# EAGLE design imu_3_xy (EAGLE 6.1)

## Sheet 1 of 2
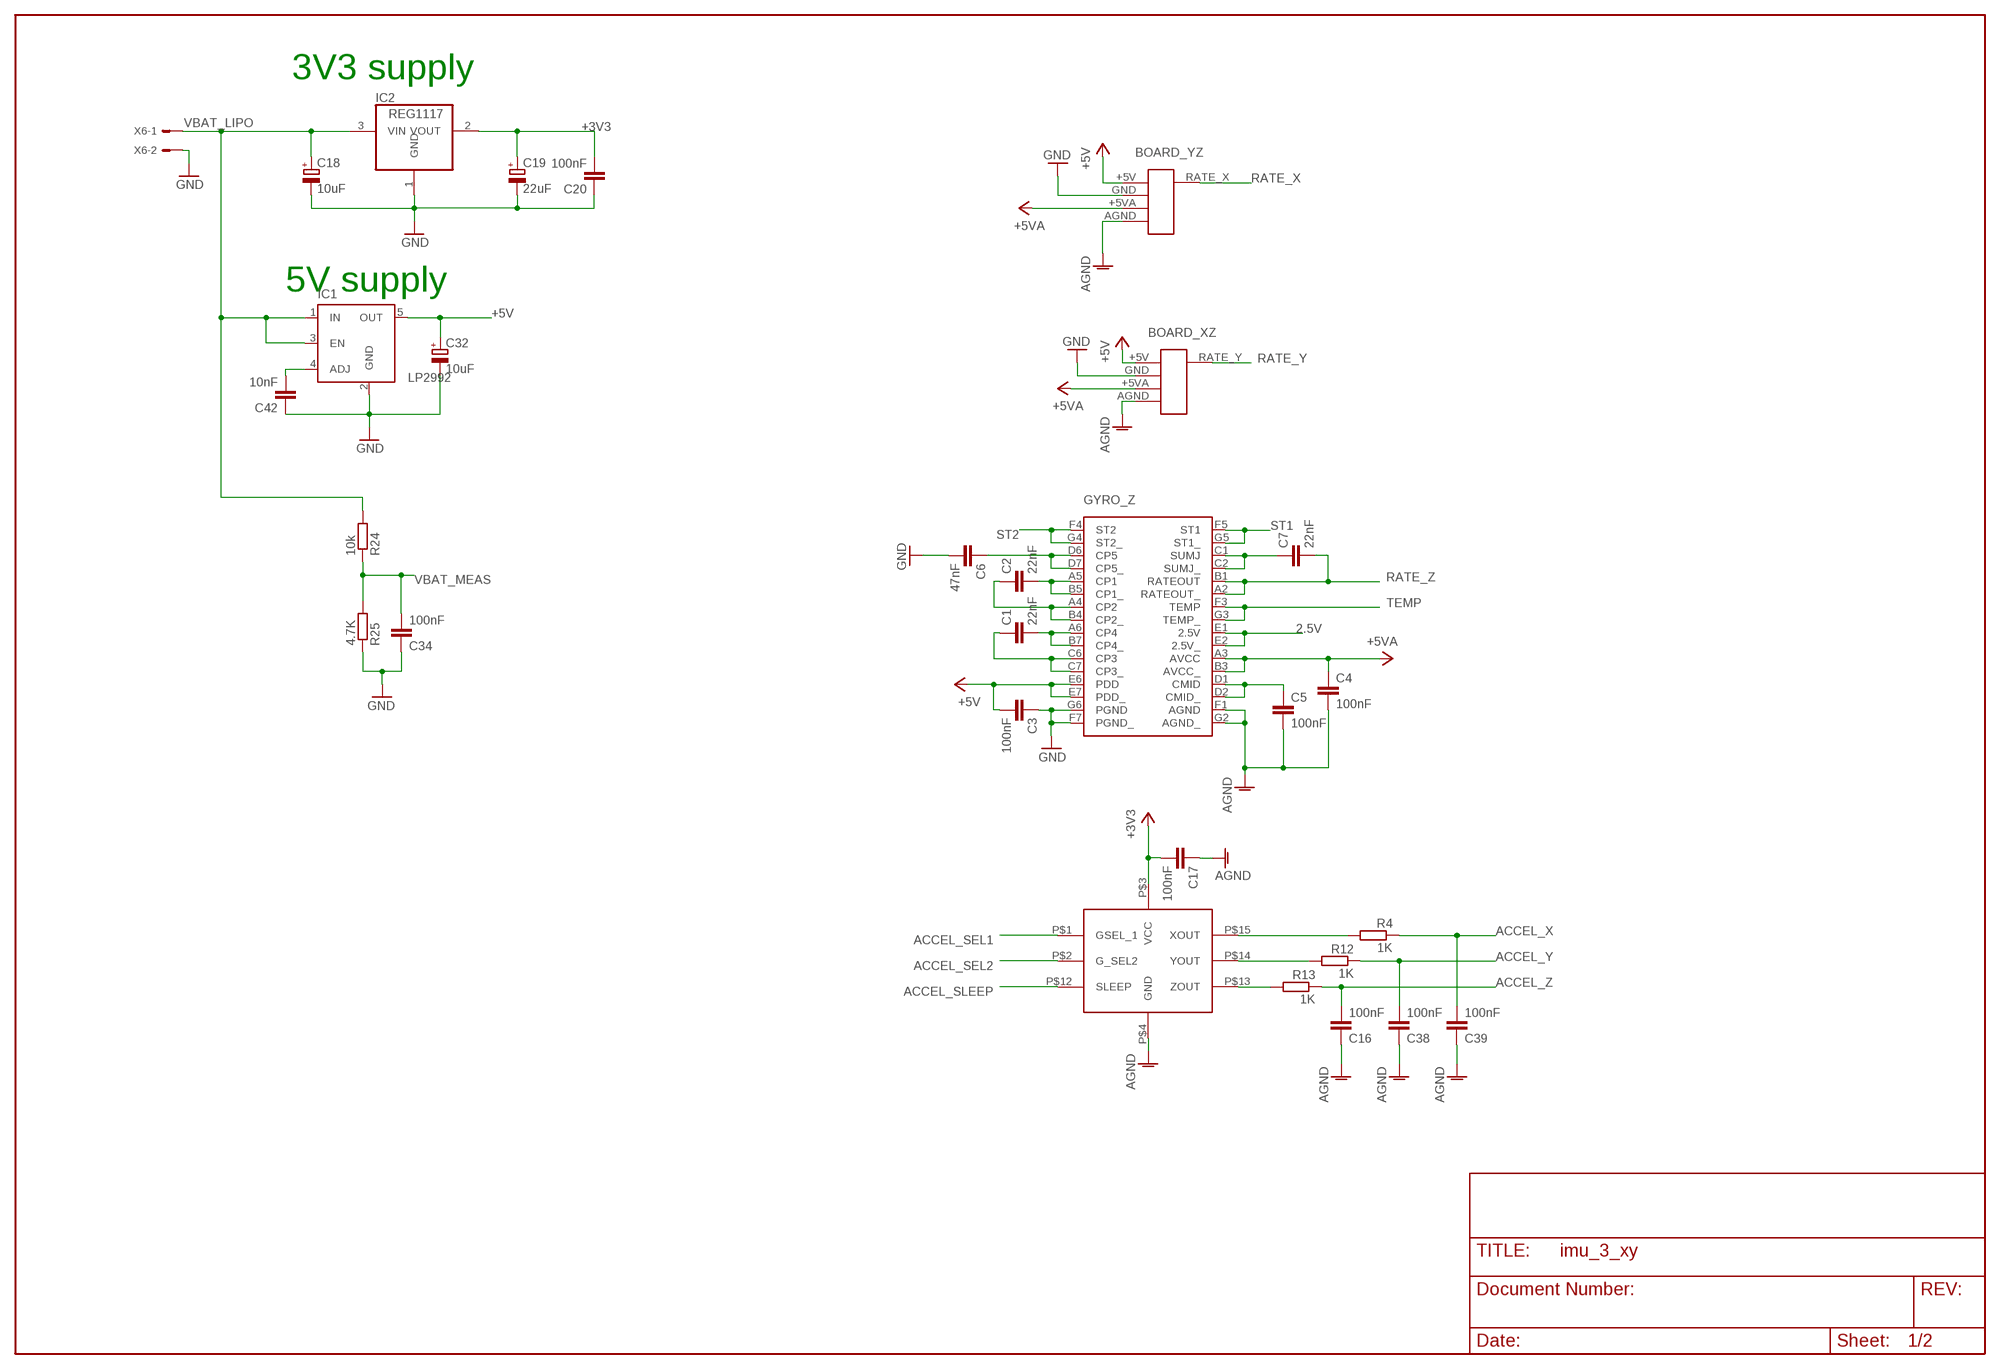
[diagram p0: schematic, sheet 1]

### Parts
BOARD_XZ  IMU_XZ_3  [IMU_XZ_3]
BOARD_YZ  IMU_YZ_3  [IMU_YZ_3]
C1  22nF  C-EUC0402K  [C0402K]
C2  22nF  C-EUC0402K  [C0402K]
C3  100nF  C-EUC0402K  [C0402K]
C4  100nF  C-EUC0402K  [C0402K]
C5  100nF  C-EUC0402K  [C0402K]
C6  47nF  C-EUC0402K  [C0402K]
C7  22nF  C-EUC0402K  [C0402K]
C16  100nF  C-EUC0402K  [C0402K]
C17  100nF  C-EUC0402K  [C0402K]
C18  10uF  CPOL-EUA/3216-18R  [A/3216-18R]
C19  22uF  CPOL-EUB/3528-21R  [B/3528-21R]
C20  100nF  C-EUC0603K  [C0603K]
C32  10uF  CPOL-EUA/3216-18R  [A/3216-18R]
C34  100nF  C-EUC0402K  [C0402K]
C38  100nF  C-EUC0402K  [C0402K]
C39  100nF  C-EUC0402K  [C0402K]
C42  10nF  C-EUC0402K  [C0402K]
GYRO_Z  ADXR  [BC-32]
IC1  LP2992  MIC5219BM5  [SOT23-5]
IC2  REG1117  [SOT223]
R4  1K  R-EU_R0402  [R0402]
R12  1K  R-EU_R0402  [R0402]
R13  1K  R-EU_R0402  [R0402]
R24  10k  R-EU_R0402  [R0402]
R25  4.7K  R-EU_R0402  [R0402]
U$5  MMA7260  [CASE162201]
X6  53048-02  [53048-02]

### Nets
2.5V: GYRO_Z.E1(2.5V) GYRO_Z.E2(2.5V_)
+3V3: C17.2 C19.+ C20.2 IC2.2(VOUT) U$5.P$3(VCC) ; also sheet 2
+5V: BOARD_XZ.+5V BOARD_YZ.+5V C3.2 C32.+ GYRO_Z.E6(PDD) GYRO_Z.E7(PDD_) IC1.5(OUT) ; also sheet 2
+5VA: BOARD_XZ.+5VA BOARD_YZ.+5VA C4.1 GYRO_Z.A3(AVCC) GYRO_Z.B3(AVCC_) ; also sheet 2
ACCEL_SEL1: U$5.P$1(GSEL_1) ; also sheet 2
ACCEL_SEL2: U$5.P$2(G_SEL2) ; also sheet 2
ACCEL_SLEEP: U$5.P$12(SLEEP) ; also sheet 2
ACCEL_X: C39.2 R4.1 ; also sheet 2
ACCEL_Y: C38.2 R12.1 ; also sheet 2
ACCEL_Z: C16.2 R13.1 ; also sheet 2
AGND: BOARD_XZ.AGND BOARD_YZ.AGND C4.2 C5.2 C16.1 C17.1 C38.1 C39.1 GYRO_Z.F1(AGND) GYRO_Z.G2(AGND_) U$5.P$4(GND) ; also sheet 2
GND: BOARD_XZ.GND BOARD_YZ.GND C3.1 C6.2 C18.- C19.- C20.1 C32.- C34.1 C42.1 GYRO_Z.F7(PGND_) GYRO_Z.G6(PGND) IC1.2(GND) IC2.1(GND) R25.1 X6.2 ; also sheet 2
N$1: C1.2 GYRO_Z.A6(CP4) GYRO_Z.B7(CP4_)
N$2: C1.1 GYRO_Z.C6(CP3) GYRO_Z.C7(CP3_)
N$3: C2.2 GYRO_Z.A5(CP1) GYRO_Z.B5(CP1_)
N$4: C2.1 GYRO_Z.A4(CP2) GYRO_Z.B4(CP2_)
N$6: R4.2 U$5.P$15(XOUT)
N$8: C7.1 GYRO_Z.C1(SUMJ) GYRO_Z.C2(SUMJ_)
N$9: C6.1 GYRO_Z.D6(CP5) GYRO_Z.D7(CP5_)
N$10: C5.1 GYRO_Z.D1(CMID) GYRO_Z.D2(CMID_)
N$11: R12.2 U$5.P$14(YOUT)
N$12: R13.2 U$5.P$13(ZOUT)
N$23: C42.2 IC1.4(ADJ)
RATE_X: BOARD_YZ.RATE_X(RATE) ; also sheet 2
RATE_Y: BOARD_XZ.RATE_Y(RATE) ; also sheet 2
RATE_Z: C7.2 GYRO_Z.A2(RATEOUT_) GYRO_Z.B1(RATEOUT) ; also sheet 2
ST1: GYRO_Z.F5(ST1) GYRO_Z.G5(ST1_)
ST2: GYRO_Z.F4(ST2) GYRO_Z.G4(ST2_)
TEMP: GYRO_Z.F3(TEMP) GYRO_Z.G3(TEMP_) ; also sheet 2
VBAT_LIPO: C18.+ IC1.1(IN) IC1.3(EN) IC2.3(VIN) R24.2 X6.1
VBAT_MEAS: C34.2 R24.1 R25.2 ; also sheet 2

### Notes on the sheet
- 3V3 supply
- 5V supply

## Sheet 2 of 2
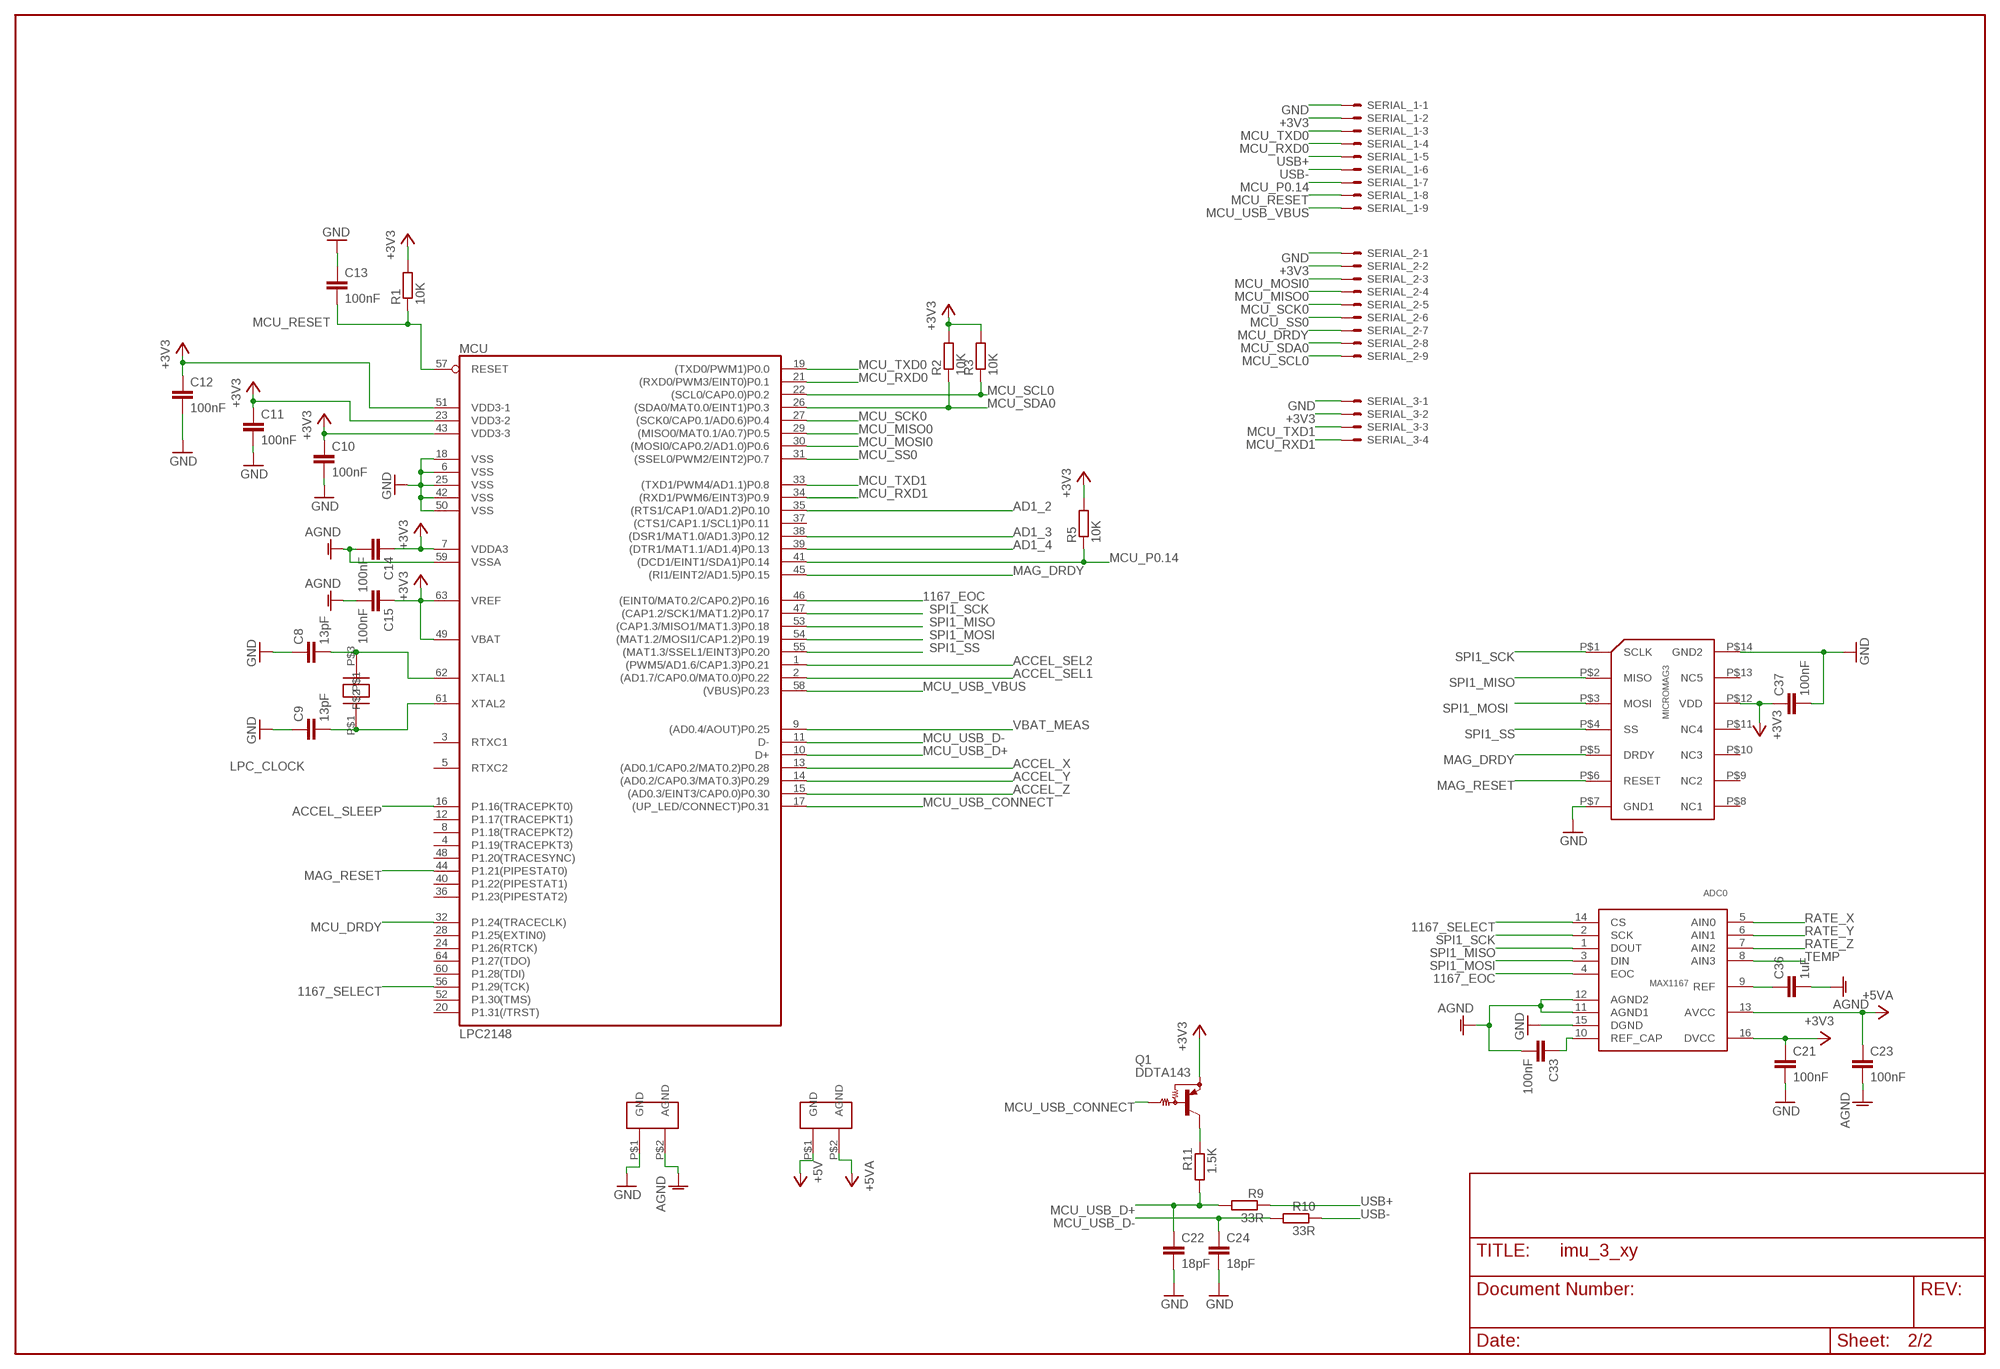
[diagram p1: schematic, sheet 2]

### Parts
ADC0  MAX1167  [QSOP16]
C8  13pF  C-EUC0402K  [C0402K]
C9  13pF  C-EUC0402K  [C0402K]
C10  100nF  C-EUC0402K  [C0402K]
C11  100nF  C-EUC0402K  [C0402K]
C12  100nF  C-EUC0402K  [C0402K]
C13  100nF  C-EUC0402K  [C0402K]
C14  100nF  C-EUC0402K  [C0402K]
C15  100nF  C-EUC0402K  [C0402K]
C21  100nF  C-EUC0402K  [C0402K]
C22  18pF  C-EUC0402K  [C0402K]
C23  100nF  C-EUC0402K  [C0402K]
C24  18pF  C-EUC0402K  [C0402K]
C33  100nF  C-EUC0402K  [C0402K]
C36  1uF  C-EUC0805  [C0805]
C37  100nF  C-EUC0402K  [C0402K]
CRYSTAL1  14.764Mhz  CRYSTAL_CTS  [CTS_CRYSTAL]
MCU  LPC2148  [SQFP-S-10X10-64]
Q1  DDTA143  MUN2111T1  [SC59-BEC]
R1  10K  R-EU_R0402  [R0402]
R2  10K  R-EU_R0402  [R0402]
R3  10K  R-EU_R0402  [R0402]
R5  10K  R-EU_R0402  [R0402]
R9  33R  R-EU_R1005  [R1005]
R10  33R  R-EU_R1005  [R1005]
R11  1.5K  R-EU_R1005  [R1005]
SERIAL_1  53048-09  [53048-09]
SERIAL_2  53048-09  [53048-09]
SERIAL_3  53048-04  [53048-04]
U$9  MICROMAG3  [MICROMAG3]
U$11  TEST_CON_GP  [TEST_CON_GP]
U$21  TEST_CON_GP  [TEST_CON_GP]

### Nets
1167_EOC: ADC0.4(EOC) MCU.46((EINT0/MAT0.2/CAP0.2)P0.16)
1167_SELECT: ADC0.14(CS) MCU.56(P1.29(TCK))
+3V3: ADC0.16(DVCC) C10.1 C11.1 C12.1 C14.1 C15.1 C21.1 C37.1 MCU.7(VDDA3) MCU.23(VDD3-2) MCU.43(VDD3-3) MCU.49(VBAT) MCU.51(VDD3-1) MCU.63(VREF) Q1.E R1.2 R2.2 R3.2 R5.2 SERIAL_1.2 SERIAL_2.2 SERIAL_3.2 U$9.P$12(VDD) ; also sheet 1
+5V: U$21.P$1(GND) ; also sheet 1
+5VA: ADC0.13(AVCC) C23.1 U$21.P$2(AGND) ; also sheet 1
ACCEL_SEL1: MCU.2((AD1.7/CAP0.0/MAT0.0)P0.22) ; also sheet 1
ACCEL_SEL2: MCU.1((PWM5/AD1.6/CAP1.3)P0.21) ; also sheet 1
ACCEL_SLEEP: MCU.16(P1.16(TRACEPKT0)) ; also sheet 1
ACCEL_X: MCU.13((AD0.1/CAP0.2/MAT0.2)P0.28) ; also sheet 1
ACCEL_Y: MCU.14((AD0.2/CAP0.3/MAT0.3)P0.29) ; also sheet 1
ACCEL_Z: MCU.15((AD0.3/EINT3/CAP0.0)P0.30) ; also sheet 1
AD1_2: MCU.35((RTS1/CAP1.0/AD1.2)P0.10)
AD1_3: MCU.38((DSR1/MAT1.0/AD1.3)P0.12)
AD1_4: MCU.39((DTR1/MAT1.1/AD1.4)P0.13)
AGND: ADC0.11(AGND1) ADC0.12(AGND2) C14.2 C15.2 C23.2 C33.2 C36.2 MCU.59(VSSA) U$11.P$2(AGND) ; also sheet 1
GND: ADC0.15(DGND) C8.1 C9.1 C10.2 C11.2 C12.2 C13.1 C21.2 C22.2 C24.2 C37.2 MCU.6(VSS) MCU.18(VSS) MCU.25(VSS) MCU.42(VSS) MCU.50(VSS) SERIAL_1.1 SERIAL_2.1 SERIAL_3.1 U$9.P$7(GND1) U$9.P$14(GND2) U$11.P$1(GND) ; also sheet 1
LPC_CLOCK: C9.2 CRYSTAL1.P$1 MCU.61(XTAL2)
MAG_DRDY: MCU.45((RI1/EINT2/AD1.5)P0.15) U$9.P$5(DRDY)
MAG_RESET: MCU.44(P1.21(PIPESTAT0)) U$9.P$6(RESET)
MCU_DRDY: MCU.32(P1.24(TRACECLK)) SERIAL_2.7
MCU_MISO0: MCU.29((MISO0/MAT0.1/A0.7)P0.5) SERIAL_2.4
MCU_MOSI0: MCU.30((MOSI0/CAP0.2/AD1.0)P0.6) SERIAL_2.3
MCU_P0.14: MCU.41((DCD1/EINT1/SDA1)P0.14) R5.1 SERIAL_1.7
MCU_RESET: C13.2 MCU.57(RESET) R1.1 SERIAL_1.8
MCU_RXD0: MCU.21((RXD0/PWM3/EINT0)P0.1) SERIAL_1.4
MCU_RXD1: MCU.34((RXD1/PWM6/EINT3)P0.9) SERIAL_3.4
MCU_SCK0: MCU.27((SCK0/CAP0.1/AD0.6)P0.4) SERIAL_2.5
MCU_SCL0: MCU.22((SCL0/CAP0.0)P0.2) R3.1 SERIAL_2.9
MCU_SDA0: MCU.26((SDA0/MAT0.0/EINT1)P0.3) R2.1 SERIAL_2.8
MCU_SS0: MCU.31((SSEL0/PWM2/EINT2)P0.7) SERIAL_2.6
MCU_TXD0: MCU.19((TXD0/PWM1)P0.0) SERIAL_1.3
MCU_TXD1: MCU.33((TXD1/PWM4/AD1.1)P0.8) SERIAL_3.3
MCU_USB_CONNECT: MCU.17((UP_LED/CONNECT)P0.31) Q1.B
MCU_USB_D+: C22.1 MCU.10(D+) R9.2 R11.2
MCU_USB_D-: C24.1 MCU.11(D-) R10.2
MCU_USB_VBUS: MCU.58((VBUS)P0.23) SERIAL_1.9
N$7: C8.2 CRYSTAL1.P$3 MCU.62(XTAL1)
N$14: Q1.C R11.1
N$20: ADC0.10(REF_CAP) C33.1
N$21: ADC0.9(REF) C36.1
RATE_X: ADC0.5(AIN0) ; also sheet 1
RATE_Y: ADC0.6(AIN1) ; also sheet 1
RATE_Z: ADC0.7(AIN2) ; also sheet 1
SPI1_MISO: ADC0.1(DOUT) MCU.53((CAP1.3/MISO1/MAT1.3)P0.18) U$9.P$2(MISO)
SPI1_MOSI: ADC0.3(DIN) MCU.54((MAT1.2/MOSI1/CAP1.2)P0.19) U$9.P$3(MOSI)
SPI1_SCK: ADC0.2(SCK) MCU.47((CAP1.2/SCK1/MAT1.2)P0.17) U$9.P$1(SCLK)
SPI1_SS: MCU.55((MAT1.3/SSEL1/EINT3)P0.20) U$9.P$4(SS)
TEMP: ADC0.8(AIN3) ; also sheet 1
USB+: R9.1 SERIAL_1.5
USB-: R10.1 SERIAL_1.6
VBAT_MEAS: MCU.9((AD0.4/AOUT)P0.25) ; also sheet 1
Unconnected: MCU.3(RTXC1) MCU.4(P1.19(TRACEPKT3)) MCU.5(RTXC2) MCU.8(P1.18(TRACEPKT2)) MCU.12(P1.17(TRACEPKT1)) MCU.20(P1.31(/TRST)) MCU.24(P1.26(RTCK)) MCU.28(P1.25(EXTIN0)) MCU.36(P1.23(PIPESTAT2)) MCU.37((CTS1/CAP1.1/SCL1)P0.11) MCU.40(P1.22(PIPESTAT1)) MCU.48(P1.20(TRACESYNC)) MCU.52(P1.30(TMS)) MCU.60(P1.28(TDI)) MCU.64(P1.27(TDO)) U$9.P$8(NC1) U$9.P$9(NC2) U$9.P$10(NC3) U$9.P$11(NC4) U$9.P$13(NC5)

## Library data of the parts
ADC0 = paparazzi:MAX1167: 16 bits 4 channel ADC
BOARD_XZ = paparazzi:IMU_XZ_3
BOARD_YZ = paparazzi:IMU_YZ_3
C1-C17 C20-C24 C33 C34 C36-C39 C42 = rcl:C-EU: CAPACITOR, European symbol
C18 C19 C32 = rcl:CPOL-EU: POLARIZED CAPACITOR, European symbol
CRYSTAL1 = paparazzi:CRYSTAL_CTS
GYRO_Z = paparazzi:ADXR
IC1 = v-reg-micrel:MIC5219BM5: VOLTAGE REGULATOR
IC2 = burr-brown:REG1117: 800mA and 1A Low Dropout (LDO) Positive Regulator 1.8V, 2.5V, 2.85V, 3.3V, 5V, and Adj
MCU = paparazzi:LPC2148
Q1 = transistor-pnp:MUN2111*: PNP Bias Resistor Transistor
R1-R5 R9-R13 R24 R25 = rcl:R-EU_: RESISTOR, European symbol
SERIAL_1 SERIAL_2 = con-molex:53?-09: CONNECTOR wire to board 1.25 mm (.049 inch) pitch header
SERIAL_3 = con-molex:53?-04: CONNECTOR wire to board 1.25 mm (.049 inch) pitch header
U$5 = paparazzi:MMA7260: 3 axis accelerometer
U$9 = paparazzi:MICROMAG3
U$11 U$21 = paparazzi:TEST_CON_GP
X6 = con-molex:53?-02: CONNECTOR wire to board 1.25 mm (.049 inch) pitch header

## Board
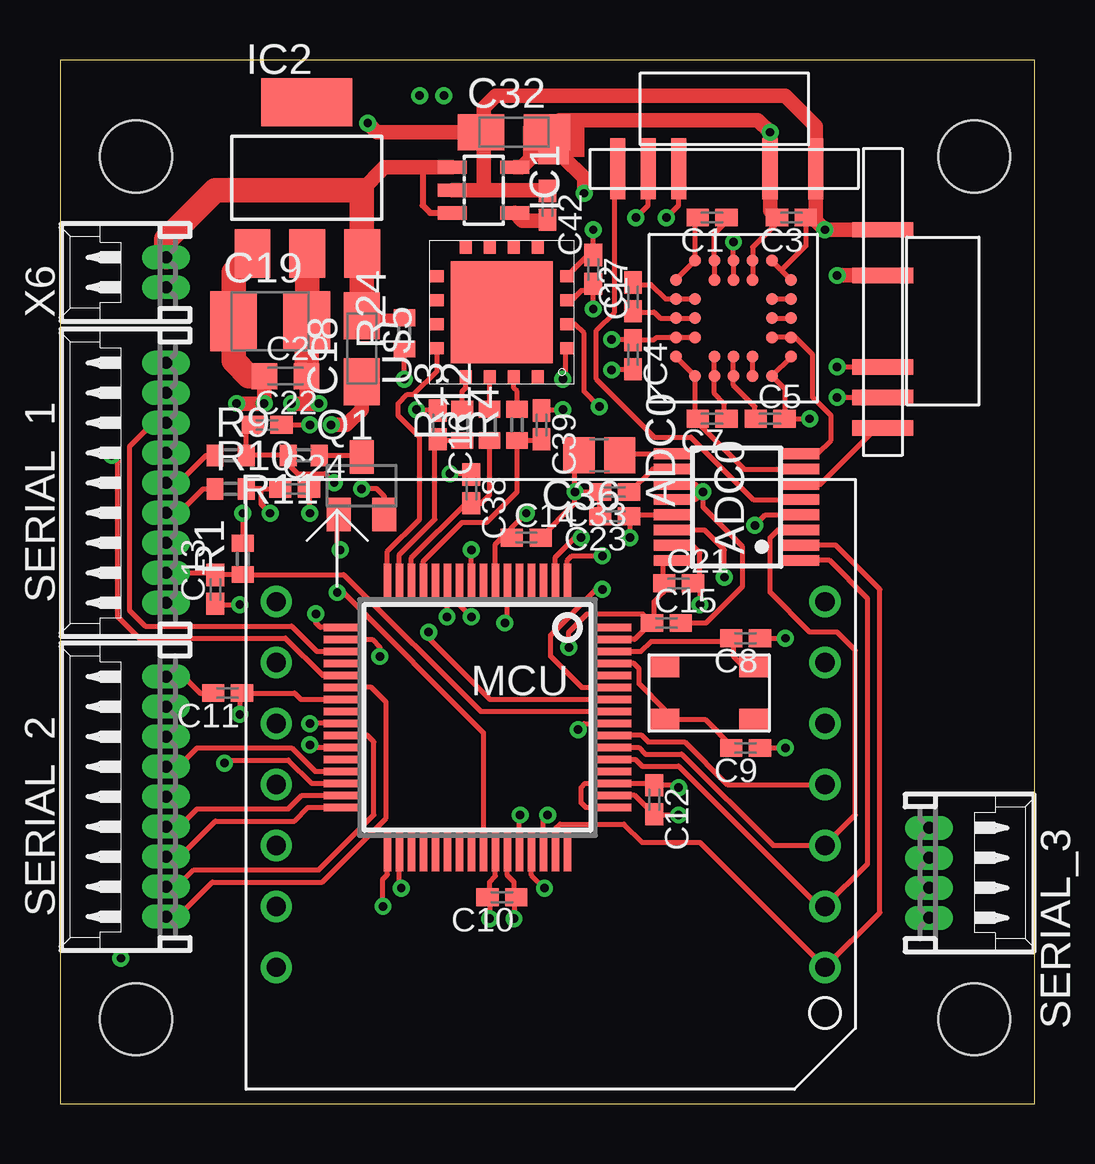
[diagram p2: board, top side]
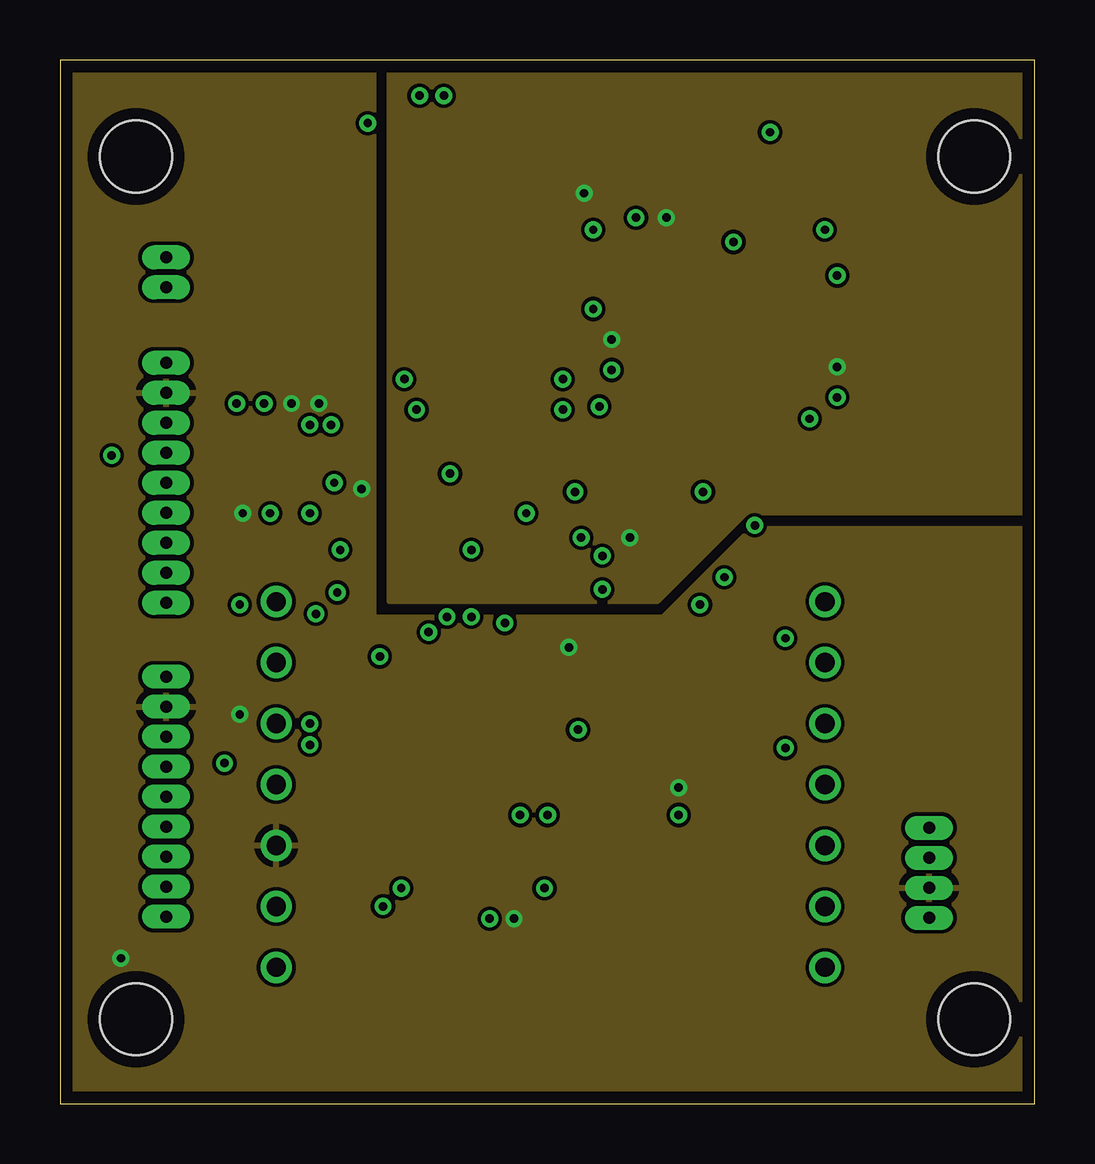
[diagram p3: board, inner layer Route2]
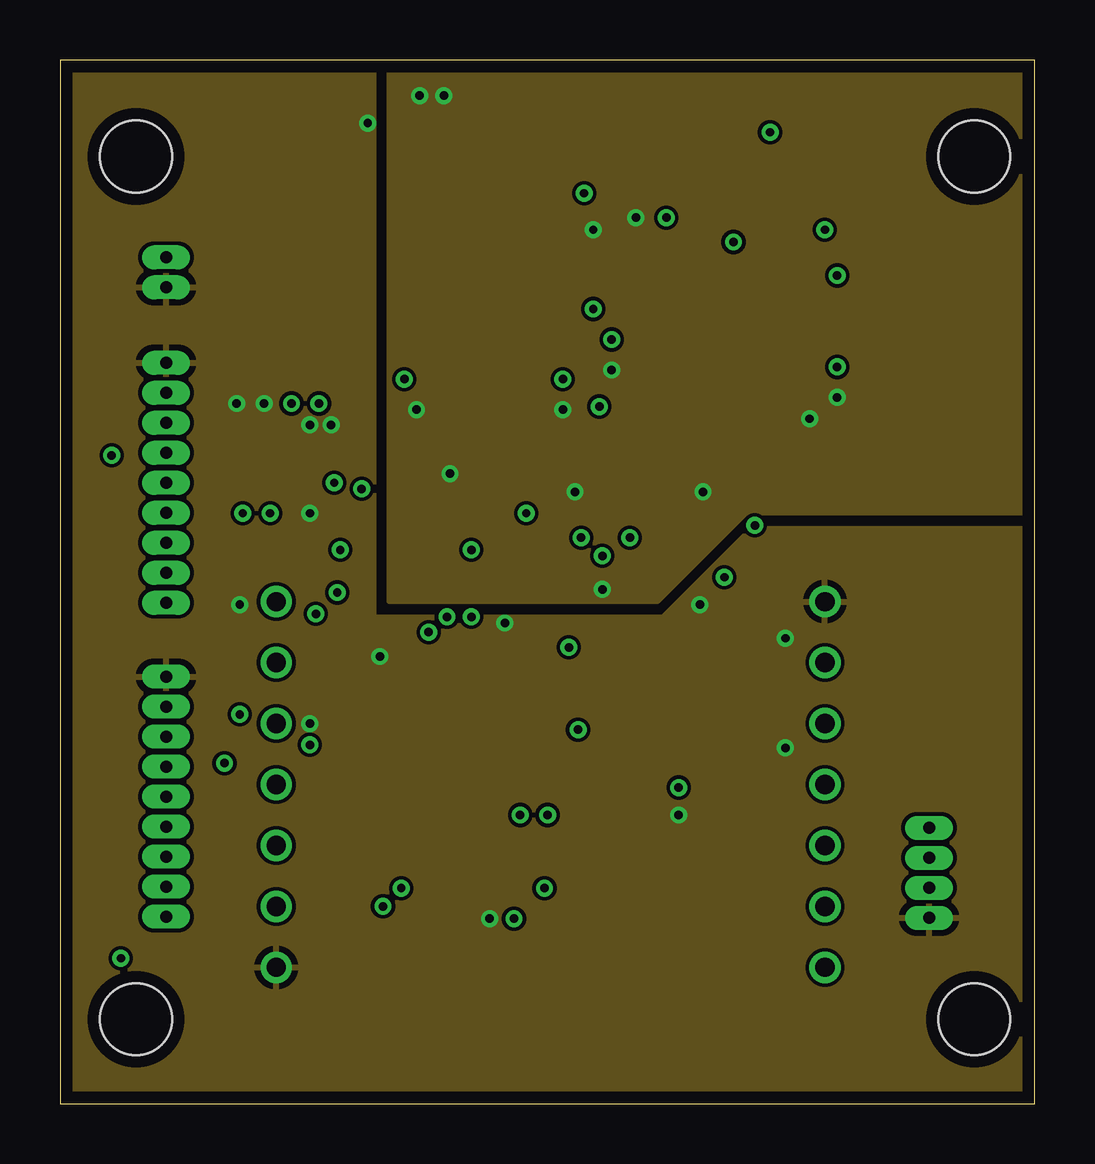
[diagram p4: board, inner layer Route15]
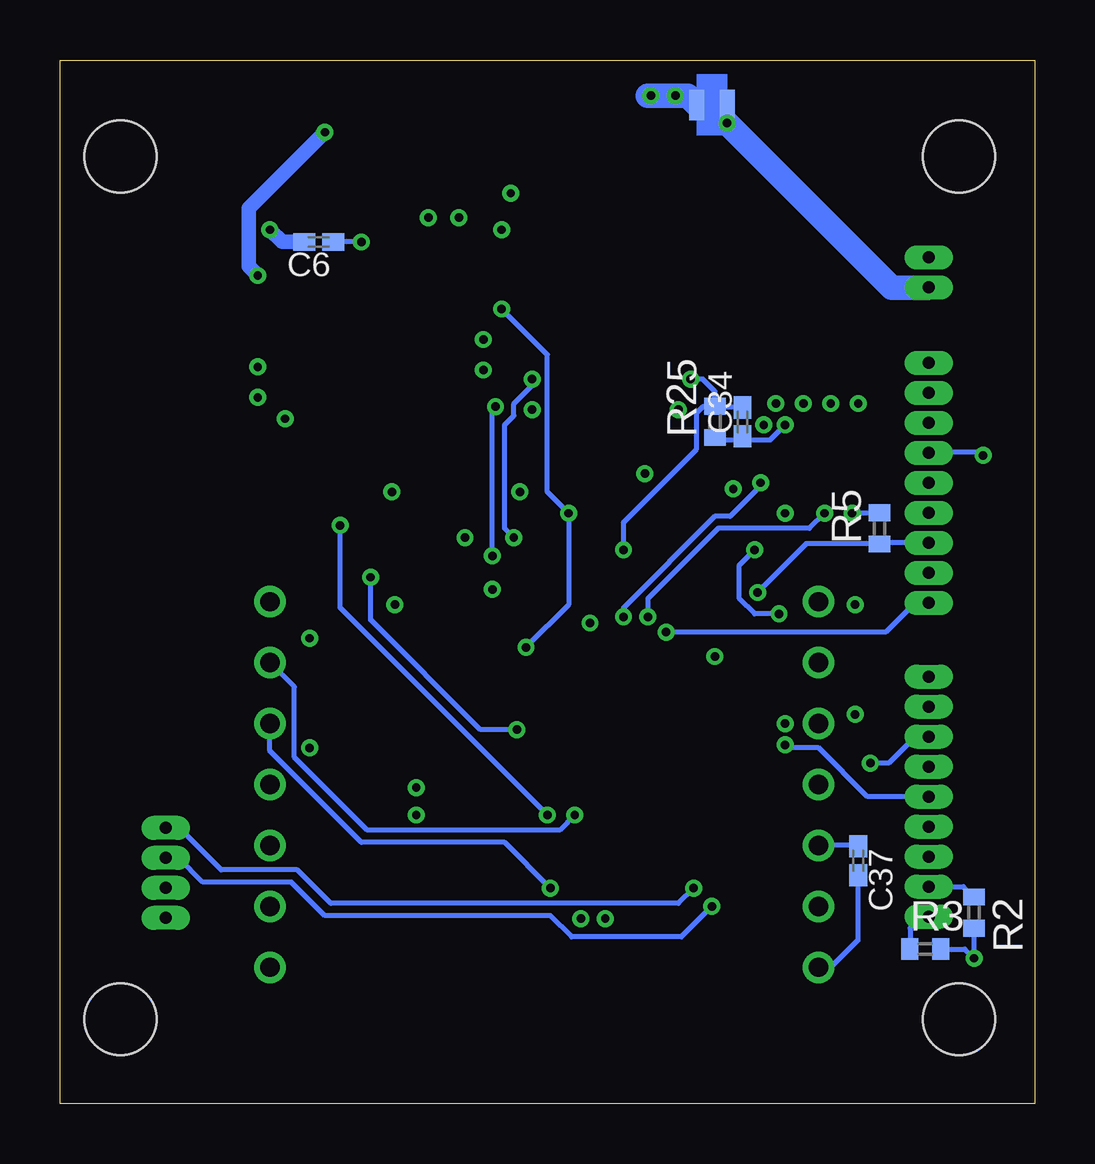
[diagram p5: board, bottom side, seen from below]

Size 40.62 x 43.48 mm. Coordinates in mm from the lower left corner, seen from the top.
Outline: 0,0 40.62,0 40.62,43.48 0,43.48 0,0
Copper layers (1*2+15*16): Top 0.035mm / dielectric 0.2mm / Route2 0.035mm / dielectric 1.5mm / Route15 0.035mm / dielectric 0.2mm / Bottom 0.035mm
Design rules: minimum track width 0.15mm, minimum drill 0.35mm, track to track 0.15mm, track to pad 0.15mm, pad to pad 0.15mm, via to via 0.15mm, smd to smd 0.15mm, copper to edge 20mil, drill to drill 8mil, minimum pad ring 10mil, minimum via ring 7mil, stop-mask expansion 4mil, vias tented up to drill 0mil, thermal gap 10mil
Holes 3 mm at 38.09,39.46 3.17,39.46 3.17,3.52 38.09,3.52

### Footprints (pad centres in the part's own frame; a part is rotated, then mirrored left to right if it is on the bottom)
QSOP16 = smd 0.45 x 1.5: 1 -2.223,-2.69; 2 -1.587,-2.69; 3 -0.953,-2.69; 4 -0.318,-2.69; 5 0.318,-2.69; 6 0.953,-2.69; 7 1.587,-2.69; 8 2.223,-2.69; 9 2.223,2.69; 10 1.587,2.69; 11 0.953,2.69; 12 0.318,2.69; 13 -0.318,2.69; 14 -0.953,2.69; 15 -1.587,2.69; 16 -2.223,2.69
IMU_XZ_3 = smd 0.635 x 2.54: +5V -1.905,0; +5VA 1.905,0; AGND 3.175,0; GND -3.81,0; RATE_Y 4.445,0
IMU_YZ_3 = smd 0.635 x 2.54: +5V 1.905,0; +5VA -1.905,0; AGND -3.175,0; GND 3.81,0; RATE_X -4.445,0
C0402K = smd 0.925 x 0.74: 1 -0.6,0; 2 0.6,0
A/3216-18R = smd 1.95 x 1.5: + 1.375,0; - -1.375,0
B/3528-21R = smd 1.95 x 2.5: + 1.525,0; - -1.525,0
C0603K = smd 1.05 x 1.08: 1 -0.875,0; 2 0.875,0
C0805 = smd 1.3 x 1.5: 1 -0.85,0; 2 0.85,0
CTS_CRYSTAL = smd 1.2 x 0.9: P$1 -1.85,-1.1; P$2 1.85,-1.1; P$3 1.85,1.1; P$4 -1.85,1.1
BC-32 = smd 0.5 x 0.5: A2 -1.6,2.4; A3 -0.8,2.4; A4 0,2.4; A5 0.8,2.4; A6 1.6,2.4; B1 -2.4,1.6; B3 -0.8,1.6; B4 0,1.6; B5 0.8,1.6; B7 2.4,1.6; C1 -2.4,0.8; C2 -1.6,0.8; C6 1.6,0.8; C7 2.4,0.8; D1 -2.4,0; D2 -1.6,0; D6 1.6,0; D7 2.4,0; E1 -2.4,-0.8; E2 -1.6,-0.8; E6 1.6,-0.8; E7 2.4,-0.8; F1 -2.4,-1.6; F3 -0.8,-1.6; F4 0,-1.6; F5 0.8,-1.6; F7 2.4,-1.6; G2 -1.6,-2.4; G3 -0.8,-2.4; G4 0,-2.4; G5 0.8,-2.4; G6 1.6,-2.4
SOT23-5 = smd 0.55 x 1.2: 1 -0.95,-1.3; 2 0,-1.3; 3 0.95,-1.3; 4 0.95,1.3; 5 -0.95,1.3
SOT223 = smd 1.499 x 2.007: 1 -2.261,-3.15; 2 0.025,-3.15; 3 2.311,-3.15 | smd 3.81 x 2.007: 4 0,3.15
SQFP-S-10X10-64 = smd 0.3 x 1.6: 1 -3.75,-5.6; 2 -3.25,-5.6; 3 -2.75,-5.6; 4 -2.25,-5.6; 5 -1.75,-5.6; 6 -1.25,-5.6; 7 -0.75,-5.6; 8 -0.25,-5.6; 9 0.25,-5.6; 10 0.75,-5.6; 11 1.25,-5.6; 12 1.75,-5.6; 13 2.25,-5.6; 14 2.75,-5.6; 15 3.25,-5.6; 16 3.75,-5.6; 33 3.75,5.6; 34 3.25,5.6; 35 2.75,5.6; 36 2.25,5.6; 37 1.75,5.6; 38 1.25,5.6; 39 0.75,5.6; 40 0.25,5.6; 41 -0.25,5.6; 42 -0.75,5.6; 43 -1.25,5.6; 44 -1.75,5.6; 45 -2.25,5.6; 46 -2.75,5.6; 47 -3.25,5.6; 48 -3.75,5.6 | smd 1.6 x 0.3: 17 5.6,-3.75; 18 5.6,-3.25; 19 5.6,-2.75; 20 5.6,-2.25; 21 5.6,-1.75; 22 5.6,-1.25; 23 5.6,-0.75; 24 5.6,-0.25; 25 5.6,0.25; 26 5.6,0.75; 27 5.6,1.25; 28 5.6,1.75; 29 5.6,2.25; 30 5.6,2.75; 31 5.6,3.25; 32 5.6,3.75; 49 -5.6,3.75; 50 -5.6,3.25; 51 -5.6,2.75; 52 -5.6,2.25; 53 -5.6,1.75; 54 -5.6,1.25; 55 -5.6,0.75; 56 -5.6,0.25; 57 -5.6,-0.25; 58 -5.6,-0.75; 59 -5.6,-1.25; 60 -5.6,-1.75; 61 -5.6,-2.25; 62 -5.6,-2.75; 63 -5.6,-3.25; 64 -5.6,-3.75
SC59-BEC = smd 1 x 1.4: B -0.95,-1.2; C 0,1.2; E 0.95,-1.2
R0402 = smd 0.7 x 0.9: 1 -0.65,0; 2 0.65,0
R1005 = smd 0.7 x 0.9: 1 -0.65,0; 2 0.65,0
53048-09 = drill 0.5 pad 0.698 long: 1 5,-1.25; 2 3.75,-1.25; 3 2.5,-1.25; 4 1.25,-1.25; 5 0,-1.25; 6 -1.25,-1.25; 7 -2.5,-1.25; 8 -3.75,-1.25; 9 -5,-1.25
53048-04 = drill 0.5 pad 0.698 long: 1 1.875,-1.25; 2 0.625,-1.25; 3 -0.625,-1.25; 4 -1.875,-1.25
CASE162201 = smd 0.5 x 0.55: P$1 -1.5,-2.7; P$2 -0.5,-2.7; P$3 0.5,-2.7; P$4 1.5,-2.7; P$9 1.5,2.7; P$10 0.5,2.7; P$11 -0.5,2.7; P$12 -1.5,2.7 | smd 0.55 x 0.5: P$5 2.7,-1.5; P$6 2.7,-0.5; P$7 2.7,0.5; P$8 2.7,1.5; P$13 -2.7,1.5; P$14 -2.7,0.5; P$15 -2.7,-0.5; P$16 -2.7,-1.5 | smd 4.25 x 4.25: P$17 0,0
MICROMAG3 = drill 0.8: P$1 -7.62,-11.43; P$2 -5.08,-11.43; P$3 -2.54,-11.43; P$4 0,-11.43; P$5 2.54,-11.43; P$6 5.08,-11.43; P$7 7.62,-11.43; P$8 7.62,11.43; P$9 5.08,11.43; P$10 2.54,11.43; P$11 0,11.43; P$12 -2.54,11.43; P$13 -5.08,11.43; P$14 -7.62,11.43
TEST_CON_GP = smd 0.635 x 1.27: P$1 -1.27,0; P$2 0,0
53048-02 = drill 0.5 pad 0.698 long: 1 0.625,-1.25; 2 -0.625,-1.25

### Placement (x,y rotation side)
ADC0  28.19,24.85 90 top
BOARD_XZ  34.29,32.6 270 top
BOARD_YZ  27.68,38.95 0 top
C1  27.17,36.92 180 top
C2  23.87,33.62 90 top
C3  30.47,36.92 180 top
C4  23.87,31.2 270 top
C5  29.59,28.54 0 top
C6  29.84,35.9 180 bottom
C7  27.17,28.54 180 top
C8  28.57,19.39 180 top
C9  28.57,14.82 180 top
C10  18.41,8.6 180 top
C11  6.98,17.11 180 top
C12  24.76,12.66 270 top
C13  6.47,21.42 90 top
C14  19.43,23.58 0 top
C15  25.27,20.03 0 top
C16  15.74,28.28 270 top
C17  22.22,34.76 270 top
C18  12.57,31.46 90 top
C19  8.76,32.6 0 top
C20  9.39,30.31 0 top
C21  25.78,21.68 0 top
C22  8.63,28.28 0 top
C23  23.11,24.47 180 top
C24  9.77,25.62 0 top
C32  18.92,40.48 0 top
C33  23.11,25.49 180 top
C34  12.19,28.41 90 bottom
C36  22.47,27.01 180 top
C37  7.36,10.12 270 bottom
C38  17.14,25.62 270 top
C39  20.06,28.28 270 top
C42  20.31,37.43 270 top
CRYSTAL1  27.05,17.11 0 top
GYRO_Z  28.06,32.73 90 top
IC1  17.65,38.06 270 top
IC2  10.28,38.57 0 top
MCU  17.39,16.09 180 top
Q1  12.57,25.74 0 top
R1  7.62,22.7 90 top
R2  2.53,7.96 270 bottom
R3  4.57,6.44 0 bottom
R4  19.04,28.28 90 top
R5  6.47,23.96 90 bottom
R9  7.11,27.01 0 top
R10  7.11,25.62 0 top
R11  10.16,27.01 180 top
R12  17.9,28.28 90 top
R13  16.76,28.28 90 top
R24  14.35,32.09 90 top
R25  13.33,28.41 90 bottom
SERIAL_1  3.17,25.87 90 top
SERIAL_2  3.17,12.79 90 top
SERIAL_3  37.46,9.61 270 top
U$5  18.41,32.98 90 top
U$9  20.44,13.3 90 top
U$11  14.09,41.62 180 bottom
U$21  20.57,39.46 270 top
X6  3.17,34.63 90 top

### Tracks (layer width: path | path; a pad name or v marks a point on that pad's centre or on a via)
2.5V
  Top 0.203: 28.84,30.33 28.82,30.31 | GYRO_Z.E1 28.84,30.33 | GYRO_Z.E2 28.86,30.35 28.84,30.33
1167_EOC  (via drill 0.35 pad 0.61)
  Top 0.203: MCU.46 20.14,11.86 v20.31,12.03 | ADC0.4 29.39,24.54 v28.95,24.09
  Bottom 0.203: v20.31,12.03 28.95,20.66 v28.95,24.09
1167_SELECT  (via drill 0.35 pad 0.61)
  Top 0.203: ADC0.14 26.86,23.9 27.68,23.08 v27.68,21.93 | MCU.56 21.84,15.84 v21.58,15.58
  Bottom 0.203: v27.68,21.93 27.68,20.15 23.11,15.58 v21.58,15.58
+3V3  (via drill 0.35 pad 0.61)
  Top 0.203: U$5.P$3 21.32,33.48 21.71,33.87 22.22,33.87 | v22.22,33.11 22.22,33.87 | v19.43,24.6 18.79,23.96 18.79,23.58 C14.1 18.83,23.68 18.66,23.84 18.14,23.32 MCU.7 | 22.22,33.87 C17.2 | 25.14,21.68 C21.1 | ADC0.16 25.14,22.63 25.14,21.68 | C15.1 24.63,20.03 23.95,19.34 MCU.63 | C15.1 24.29,20.41 21.97,20.41 21.2,19.65 v21.2,19.01 | MCU.43 18.64,9.51 18.92,9.23 18.92,8.6 | 18.92,8.6 v18.92,7.71 | C10.1 18.92,8.6 | MCU.49 21.91,12.34 21.71,12.54 21.71,13.17 21.88,13.34 MCU.51 24.72,13.34 24.76,13.3 | 24.76,13.3 25.65,13.3 v25.78,13.17 | 24.76,13.3 C12.1 | v7.49,16.22 7.49,17.01 C11.1 9.77,17.11 10.04,16.84 MCU.23 | 25.14,21.68 25.14,21.3 24.76,20.92 24.76,20.12 C15.1 | v7.62,24.6 R1.2 | Q1.E 13.52,25.3 13.2,25.62 v12.57,25.62
  Top 0.61: 10.28,29.17 10.28,30.32 | v9.65,29.17 10.28,29.17 | 10.28,29.17 v10.79,29.17
  Top 1.016: C19.+ | IC2.2 10.31,32.6 C19.+ | C20.2 10.28,30.31 10.28,30.32 C19.+
  Bottom 0.203: v22.22,33.11 20.31,31.2 20.31,25.49 v19.43,24.6 19.43,20.79 v21.2,19.01 | C37.1 7.4,10.76 U$9.P$12 | R2.2 v2.53,6.06 2.92,6.44 R3.2 | R5.2 6.47,24.6 v7.62,24.6
  pour Route2: 0.12,43.27 13.08,43.27 13.08,20.28 25.14,20.28 28.82,23.96 40.51,23.96 40.51,0.22 0.12,0.22
+5V  (via drill 0.35 pad 0.61)
  Top 0.203: 28.86,34.38 GYRO_Z.E6 | 28.86,34.38 GYRO_Z.E7 28.86,35.69 29.88,36.7 C3.2 | 28.86,34.38 28.82,34.38
  Top 0.61: IC1.5 19.23,39.01 20.31,40.09 20.29,40.12 C32.+ 20.31,40.48 U$21.P$1 20.82,40.98 29.08,40.98 v29.59,40.48 BOARD_YZ.+5V 29.59,37.21 C3.2 | v32.38,34.51 BOARD_XZ.+5V
  Bottom 0.61: v29.59,40.48 32.76,37.3 32.76,34.89 v32.38,34.51
+5VA  (via drill 0.35 pad 0.61)
  Top 0.203: v32.38,30.7 BOARD_XZ.+5VA | v22.98,31.84 23.84,31.84 C4.1 23.87,31.84 24.76,31.84 24.85,31.93 GYRO_Z.A3 25.66,31.95 | 25.66,31.95 25.65,31.97 | GYRO_Z.B3 25.69,31.93 25.66,31.95 | C23.1 23.74,24.47 | ADC0.13 23.81,24.54 23.74,24.47 | 23.74,24.47 v23.74,23.58 | BOARD_YZ.+5VA 25.78,37.43 v25.27,36.92
  Top 0.61: U$21.P$2 20.95,39.46 21.84,38.57 v21.84,37.93
  pour Route2: 13.71,43.27 40.51,43.27 40.51,24.6 28.57,24.6 24.89,20.92 13.71,20.92
ACCEL_SEL1  (via drill 0.35 pad 0.61)
  Top 0.203: MCU.2 20.64,22.77 21.46,23.58 v21.71,23.58 | U$5.P$1 21.09,31.46 21.08,31.46 21.08,30.31 v20.95,30.19
  Bottom 0.203: v21.71,23.58 22.09,23.96 22.09,28.28 21.71,28.66 21.71,29.17 20.95,29.93 v20.95,30.19
ACCEL_SEL2  (via drill 0.35 pad 0.61)
  Top 0.203: MCU.1 21.14,22.63 21.33,22.82 v22.6,22.82 | v22.47,29.04 21.84,29.68 21.84,32.09 21.45,32.48 U$5.P$2
  Bottom 0.203: v22.6,22.82 22.6,28.92 v22.47,29.04
ACCEL_SLEEP
  Top 0.203: MCU.16 13.64,23.01 14.98,24.35 14.98,27.77 14.09,28.66 14.09,29.17 14.47,29.55 14.73,29.55 15.71,30.54 U$5.P$12
ACCEL_X
  Top 0.203: MCU.13 15.14,22.6 16.76,24.22 17.77,24.22 19.04,25.49 R4.1 | R4.1 19.04,27.65 | C39.2 20.06,27.65 20.05,27.63 R4.1
ACCEL_Y
  Top 0.203: 17.9,27.65 R12.1 17.9,25.36 17.56,25.02 C38.2 16.92,25.02 14.64,22.74 MCU.14
ACCEL_Z
  Top 0.203: R13.1 15.76,27.63 15.74,27.65 C16.2 15.71,27.65 15.62,27.65 15.62,24.35 14.14,22.87 MCU.15
AGND  (via drill 0.35 pad 0.61)
  Top 0.203: U$5.P$4 22.02,35.39 22.22,35.39 C17.1 v22.22,36.41 | GYRO_Z.F1 29.65,30.31 29.59,30.31 | GYRO_Z.F1 GYRO_Z.G2 | GYRO_Z.F1 30.22,29.77 30.22,28.54 C5.2 v31.24,28.54 | v32.38,29.43 BOARD_XZ.AGND | C4.2 23.84,30.57 v22.98,30.57 | C39.1 20.1,28.92 v20.95,28.92 | C16.1 15.71,28.92 v14.85,28.92 | C38.1 17.1,26.25 v16.25,26.25 | C23.2 22.47,24.51 22.47,25.49 C33.2 v21.46,25.49 | C36.2 21.46,26.85 v21.46,25.49 | C14.2 21.46,25.02 v21.46,25.49 | ADC0.11 26.47,25.81 v26.79,25.49 | ADC0.12 26.47,25.17 v26.79,25.49 | MCU.59 21.73,17.34 20.44,18.63 20.44,19.52 22.35,21.42 v22.6,21.42 | C15.2 26.92,20.03 28.44,21.55 28.44,23.2 26.79,24.85 v26.79,25.49 | BOARD_YZ.AGND 24.51,37.43 v24,36.92
  Bottom 1.016: U$11.P$2 14.47,42 v14.98,42 v16,42 16.12,42
  pour Route15: 13.71,43.27 40.51,43.27 40.51,24.6 28.57,24.6 24.89,20.92 13.71,20.92
GND  (via drill 0.35 pad 0.61)
  Top 0.203: GYRO_Z.G6 30.47,34.34 30.47,34.38 30.41,34.38 30.06,34.73 | 30.06,34.73 GYRO_Z.F7 | 30.06,34.73 31.07,35.74 31.07,36.88 31.11,36.92 | ADC0.15 26.35,23.27 26.66,22.95 26.66,21.68 | C21.2 26.66,21.68 | 26.66,21.68 v26.66,20.79 | C8.1 v30.22,19.39 | C24.2 10.41,25.58 v10.41,24.6 | C22.2 v10.41,28.28 | MCU.42 18.14,9.47 17.9,9.23 17.9,8.6 | 17.9,8.6 v17.9,7.71 | C10.2 17.9,8.6 | MCU.50 23.95,12.84 24.76,12.03 C12.2 24.79,12.03 v25.78,12.03 | SERIAL_2.1 5.16,17.79 5.84,17.11 C11.2 6.47,17.11 | C9.1 v30.22,14.82 | MCU.25 v10.41,15.84 | MCU.18 13,19.34 13.33,19.01 v13.33,18.63 | MCU.6 18.64,20.13 v18.54,20.03 | C13.1 6.51,20.79 v7.49,20.79 | 31.11,36.92 31.36,36.92 v31.87,36.41 | 31.11,36.92 C3.1
  Top 0.61: C42.1 20.31,38.06 17.65,38.06 | 17.65,38.06 IC1.2 | 17.65,40.37 C32.- 13.2,40.48 v12.82,40.86 | C18.- 12.57,28.92 11.93,28.28 v11.3,28.28 | C20.1 v8.52,29.17 v7.36,29.17 | 17.65,40.37 17.65,41.49 18.16,42 30.22,42 31.49,40.73 BOARD_YZ.GND 31.49,36.79 v31.87,36.41 BOARD_XZ.GND | 17.65,40.37 17.65,38.06
  Top 1.016: IC2.1 7.23,34.63 C19.- | C20.1 7.87,30.31 7.23,30.95 C19.- | C19.-
  Bottom 0.203: v10.41,28.28 11.04,27.65 12.19,27.65 | 12.19,27.65 C34.1 | R25.1 13.22,27.65 12.19,27.65 | U$9.P$14 8.5,5.68 7.36,6.82 C37.2
  Bottom 0.61: v12.82,40.86 U$11.P$1 | v31.87,36.41 31.36,35.9 C6.2
  Bottom 1.016: v12.82,40.86 5.96,34 4.44,34
  pour Route15: 0.12,43.27 13.08,43.27 13.08,20.28 25.14,20.28 28.82,23.96 40.51,23.96 40.51,0.22 0.12,0.22
LPC_CLOCK
  Top 0.203: C9.2 28.06,14.82 26.88,16.01 CRYSTAL1.P$1 25.2,16.42 24.12,17.49 24.12,18.12 23.91,18.34 MCU.61
MAG_DRDY  (via drill 0.35 pad 0.61)
  Top 0.203: MCU.45 19.64,9.52 v20.19,8.98
  Bottom 0.203: v20.19,8.98 22.09,10.88 28.06,10.88 31.87,14.69 U$9.P$5
MAG_RESET  (via drill 0.35 pad 0.61)
  Top 0.203: MCU.44 19.14,12 v19.17,12.03
  Bottom 0.203: v19.17,12.03 19.81,11.39 27.81,11.39 30.86,14.44 30.86,17.36 U$9.P$6
MCU_DRDY
  Top 0.203: MCU.32 10.34,12.34 9.77,11.77 6.47,11.77 4.99,10.29 SERIAL_2.7
MCU_MISO0
  Top 0.203: MCU.29 10.63,13.84 9.65,14.82 5.71,14.82 4.93,14.04 SERIAL_2.4
MCU_MOSI0  (via drill 0.35 pad 0.61)
  Top 0.203: MCU.30 10.49,13.34 9.52,14.31 6.98,14.31 v6.85,14.19
  Bottom 0.203: v6.85,14.19 6.09,14.19 4.99,15.29 SERIAL_2.3
MCU_P0.14  (via drill 0.35 pad 0.61)
  Top 0.203: MCU.41 17.64,15.46 11.81,21.3 v11.55,21.3
  Bottom 0.203: v11.55,21.3 9.52,23.33 R5.1 | R5.1 | SERIAL_1.7 6.43,23.37 R5.1
MCU_RESET
  Top 0.203: SERIAL_1.8 6.41,22.12 6.47,22.06 | 6.47,22.06 C13.2 | 6.47,22.06 7.6,22.06 R1.1 11.82,22.04 11.93,21.93 17.52,16.34 MCU.57
MCU_RXD0  (via drill 0.35 pad 0.61)
  Top 0.203: MCU.21 10.95,17.84 9.39,19.39 3.3,19.39 2.41,20.28 2.41,26.76 v2.15,27.01
  Bottom 0.203: SERIAL_1.4 4.44,27.14 2.28,27.14 v2.15,27.01
MCU_RXD1  (via drill 0.35 pad 0.61)
  Top 0.203: MCU.34 14.14,9.05 v14.22,8.98
  Bottom 0.203: v14.22,8.98 14.85,8.34 29.33,8.34 30.73,9.74 33.9,9.74 35.68,11.52 36.19,11.52 36.19,11.51 SERIAL_3.4
MCU_SCK0  (via drill 0.35 pad 0.61)
  Top 0.203: MCU.27 10.52,14.84 v10.41,14.95
  Bottom 0.203: SERIAL_2.5 6.98,12.79 9.01,14.82 10.28,14.82 v10.41,14.95
MCU_SCL0
  Top 0.203: MCU.22 12.97,17.34 13.58,16.73 13.58,11.9 10.92,9.23 6.35,9.23 4.9,7.79 SERIAL_2.9
  Bottom 0.203: SERIAL_2.9 4.74,7.79 5.2,7.33 5.2,6.44 R3.1
MCU_SDA0
  Top 0.203: MCU.26 12.81,15.34 13.08,15.08 13.08,12.03 10.79,9.74 5.58,9.74 4.88,9.04 SERIAL_2.8
  Bottom 0.203: R2.1 2.98,9.04 SERIAL_2.8
MCU_SS0
  Top 0.203: MCU.31 10.08,12.84 9.52,12.28 5.71,12.28 4.97,11.54 SERIAL_2.6
MCU_TXD0
  Top 0.203: MCU.19 10.71,18.84 9.65,19.9 3.55,19.9 2.92,20.54 2.92,27.39 3.89,28.37 SERIAL_1.3
MCU_TXD1  (via drill 0.35 pad 0.61)
  Top 0.203: MCU.33 13.64,9.55 13.46,9.36 v13.46,8.22
  Bottom 0.203: v13.46,8.22 14.73,6.95 19.3,6.95 20.19,7.84 29.59,7.84 30.98,9.23 34.67,9.23 35.68,10.25 36.19,10.25 SERIAL_3.3
MCU_USB_CONNECT  (via drill 0.35 pad 0.61)
  Top 0.203: MCU.17 10.85,19.84 10.66,20.03 v10.66,20.41 | Q1.B 11.56,24.6 11.55,24.6 11.55,23.2 v11.68,23.08
  Bottom 0.203: v10.66,20.41 11.68,20.41 12.31,21.04 12.31,22.44 v11.68,23.08
MCU_USB_D+  (via drill 0.35 pad 0.61)
  Top 0.203: C22.1 7.87,28.28 7.76,28.17 R9.2 R11.2 9.52,27.01 9.52,26.63 9.9,26.25 11.04,26.25 v11.43,25.87 | MCU.10 16.63,21.68 16.63,20.79 v17.14,20.28
  Bottom 0.203: v17.14,20.28 17.14,20.66 13.33,24.47 12.7,24.47 11.43,25.74 v11.43,25.87
MCU_USB_D-  (via drill 0.35 pad 0.61)
  Top 0.203: 8.38,25.62 C24.1 | 8.38,25.62 R10.2 | MCU.11 16.14,20.3 v16.12,20.28 | v8.76,24.6 8.38,24.98 8.38,25.62
  Bottom 0.203: v16.12,20.28 16.12,21.04 13.2,23.96 9.39,23.96 v8.76,24.6
MCU_USB_VBUS  (via drill 0.35 pad 0.61)
  Top 0.203: MCU.58 17.91,16.84 15.36,19.39 v15.36,19.65
  Bottom 0.203: v15.36,19.65 6.22,19.65 5,20.87 SERIAL_1.9
N$1
  Top 0.203: GYRO_Z.A6 26.41,35.08 26.41,35.14 26.45,35.14 GYRO_Z.B7 26.46,36.92 C1.2 26.66,36.92
N$2
  Top 0.203: 27.26,34.38 GYRO_Z.C6 | 27.26,34.38 GYRO_Z.C7 27.26,36.25 27.81,36.79 27.77,36.83 C1.1 | 27.26,34.38 27.3,34.38
N$3
  Top 0.203: 25.66,33.5 25.65,33.49 | 25.66,33.5 GYRO_Z.A5 25.23,33.53 24.63,34.12 23.87,34.12 C2.2 | GYRO_Z.B5 25.69,33.53 25.66,33.5
N$4
  Top 0.203: GYRO_Z.A4 | GYRO_Z.A4 GYRO_Z.B4 | GYRO_Z.A4 25.01,32.73 24.76,32.98 23.87,32.98 C2.1
N$6
  Top 0.203: U$5.P$15 18.91,29.81 19.04,29.68 R4.2 19.04,28.79
N$7
  Top 0.203: MCU.62 24.21,18.84 24.63,19.27 27.81,19.27 27.93,19.39 | CRYSTAL1.P$3 28.49,18.21 28.06,18.63 28.06,19.27 27.93,19.39 | 27.93,19.39 C8.2
N$8
  Top 0.203: GYRO_Z.C1 27.26,30.31 27.3,30.31 | GYRO_Z.C1 GYRO_Z.C2 | GYRO_Z.C1 27.26,29.59 27.68,29.17 27.68,28.54 C7.1
N$9  (via drill 0.35 pad 0.61)
  Top 0.203: GYRO_Z.D6 GYRO_Z.D7 v28.06,35.9
  Bottom 0.203: v28.06,35.9 C6.1
N$10
  Top 0.203: GYRO_Z.D1 28.06,30.31 | GYRO_Z.D1 GYRO_Z.D2 | GYRO_Z.D1 28.06,29.93 28.95,29.04 28.95,28.54 C5.1
N$11
  Top 0.203: R12.2 17.91,28.93 U$5.P$14
N$12
  Top 0.203: U$5.P$13 16.91,29.83 16.76,29.68 R13.2
N$14
  Top 0.203: Q1.C 12.57,27.01 R11.1
N$20
  Top 0.203: C33.1 23.74,25.49 24.7,26.44 ADC0.10
N$21
  Top 0.203: C36.1 23.36,27.01 23.36,27.08 ADC0.9
N$23
  Top 0.61: C42.2 20.31,36.79 19.27,36.79 IC1.4
RATE_X
  Top 0.203: ADC0.5 28.89,25.17 26.28,27.77 24.76,27.77 22.35,30.19 22.35,32.22 23.11,32.98 23.11,38.95 BOARD_YZ.RATE_X
RATE_Y
  Top 0.203: BOARD_XZ.RATE_Y 34.03,28.16 31.68,25.81 ADC0.6
RATE_Z
  Top 0.203: GYRO_Z.A2 26.41,30.38 26.41,30.31 26.45,30.31 GYRO_Z.B1 26.46,28.54 | 26.46,28.54 C7.2 26.57,28.38 28.51,26.44 ADC0.7 | 26.46,28.54 26.41,28.54
SPI1_MISO
  Top 0.203: MCU.53 23.97,14.34 24.25,14.06 25.78,14.06 31.62,8.22 U$9.P$2 33.65,10 33.65,21.04 32.06,22.63 ADC0.1
SPI1_MOSI
  Top 0.203: MCU.54 24.1,14.84 24.38,14.57 25.9,14.57 29.71,10.76 U$9.P$3 33.14,12.03 33.14,18.88 32.38,19.65 31.24,19.65 29.59,21.3 29.59,23.58 29.9,23.9 ADC0.3
SPI1_SCK
  Top 0.203: MCU.47 20.64,11.47 20.82,11.65 23.49,11.65 24.25,10.88 26.66,10.88 U$9.P$1 34.16,7.96 34.16,21.42 32.32,23.27 ADC0.2
SPI1_SS
  Top 0.203: U$9.P$4 27.81,13.3 26.03,15.08 24.51,15.08 24.24,15.34 MCU.55
ST1
  Top 0.203: 30.46,33.5 30.47,33.49 | 30.46,33.5 GYRO_Z.G5 | GYRO_Z.F5 30.44,33.53 30.46,33.5
ST2
  Top 0.203: 30.47,32.73 GYRO_Z.G4 GYRO_Z.F4
TEMP
  Top 0.203: 30.46,31.95 30.47,31.97 | 30.46,31.95 GYRO_Z.G3 30.64,31.93 31.36,31.2 31.36,29.43 32.13,28.66 32.13,27.65 31.55,27.08 ADC0.8 | GYRO_Z.F3 30.44,31.93 30.46,31.95
USB+
  Top 0.203: R9.1 6.09,27.01 4.95,25.87 SERIAL_1.5
USB-
  Top 0.203: R10.1 5.96,25.62 4.97,24.62 SERIAL_1.6
VBAT_LIPO
  Top 0.254: IC1.3 15.42,37.11 15.11,37.43 15.11,39.01
  Top 0.406: R24.2 12.67,32.73 C18.+
  Top 0.61: IC1.1 15.11,39.01 13.52,39.01 12.57,38.06
  Top 1.016: X6.1 4.42,36.01 6.47,38.06 12.57,38.06 12.57,35.42 | 12.57,35.42 IC2.3 | 12.57,35.42 C18.+
VBAT_MEAS  (via drill 0.35 pad 0.61)
  Top 0.203: v14.35,30.19 R24.1 | MCU.9 v17.14,23.07 v17.14,23.08
  Bottom 0.203: C34.2 12.22,29.04 13.33,29.04 | v14.35,30.19 13.84,30.19 13.33,29.68 R25.2 13.33,29.04 | v17.14,23.08 17.14,24.22 14.09,27.27 14.09,28.79 13.84,29.04 13.33,29.04

### Text on the board
tDocu: Paparazzi IMU 3 | 06/06 by Poine